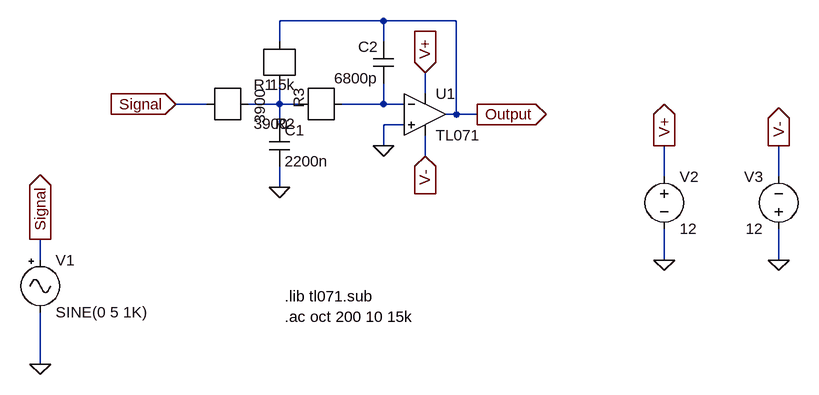
[diagram p0: schematic lowpass-mfb.asc]
lowpass-mfb.asc, the LTspice schematic file:
Version 4
SHEET 1 880 680
WIRE 160 64 0 64
WIRE 272 64 160 64
WIRE 0 96 0 64
WIRE 160 96 160 64
WIRE 224 176 224 144
WIRE -112 192 -160 192
WIRE 0 192 0 160
WIRE 0 192 -48 192
WIRE 32 192 0 192
WIRE 160 192 160 160
WIRE 160 192 96 192
WIRE 192 192 160 192
WIRE 272 208 272 64
WIRE 272 208 256 208
WIRE 304 208 272 208
WIRE 0 224 0 192
WIRE 192 224 160 224
WIRE 160 256 160 224
WIRE 224 272 224 240
WIRE 592 304 592 256
WIRE 768 304 768 256
WIRE 0 320 0 288
WIRE -368 432 -368 400
WIRE 592 432 592 384
WIRE 768 432 768 384
WIRE -368 592 -368 512
FLAG -368 592 0
FLAG 160 256 0
FLAG 0 320 0
FLAG 592 432 0
FLAG 768 432 0
FLAG 592 256 V+
IOPIN 592 256 Out
FLAG 768 256 V-
IOPIN 768 256 Out
FLAG 224 144 V+
IOPIN 224 144 In
FLAG 224 272 V-
IOPIN 224 272 In
FLAG -368 400 Signal
IOPIN -368 400 Out
FLAG 304 208 Output
IOPIN 304 208 Out
FLAG -160 192 Signal
IOPIN -160 192 In
SYMBOL opamp2 224 144 R0
SYMATTR InstName U1
SYMATTR Value TL071
SYMBOL signal -368 416 R0
SYMATTR InstName V1
SYMATTR Value SINE(0 5 1K)
SYMATTR Value2 AC 5 0
SYMBOL voltage 592 288 R0
SYMATTR InstName V2
SYMATTR Value 12
SYMBOL voltage 768 400 R180
WINDOW 0 24 96 Left 2
WINDOW 3 24 16 Left 2
SYMATTR InstName V3
SYMATTR Value 12
SYMBOL r -112 192 R0
SYMATTR InstName R1
SYMATTR Value 3900
SYMBOL r 96 192 R180
SYMATTR InstName R2
SYMATTR Value 15k
SYMBOL r 0 96 R90
SYMATTR InstName R3
SYMATTR Value 3900
SYMBOL cap -16 224 R0
SYMATTR InstName C1
SYMATTR Value 2200n
SYMBOL cap 176 160 R180
WINDOW 0 24 56 Left 2
WINDOW 3 24 8 Left 2
SYMATTR InstName C2
SYMATTR Value 6800p
TEXT 8 488 Left 2 !.lib tl071.sub\n.ac oct 200 10 15k

The netlist it stands for:
* lowpass-mfb.asc
XU1 0 N002 V+ V- Output TL071  ; pins In+ In- V+ V- OUT
V1 Signal 0 SINE(0 5 1K) AC 5 0
V2 V+ 0 12
V3 0 V- 12
R1 N001 Signal 3900
R2 N001 N002 15k
R3 N001 Output 3900
C1 N001 0 2200n
C2 N002 Output 6800p
.lib tl071.sub
.ac oct 200 10 15k
.backanno
.end